# Altium schematic sheet atmega128 schematic.SchDoc
size A2; SheetNumber: 1; SheetTotal: 1; SPICEModelCacheGVUNZBFE: <root> / <DocumentId>GVUNZBFE</DocumentId> / <CacheFrame Number="0"> / <Model Name="zener" Kind="MDL"> / <Text>*ZENER / *Default Zener 10V @ 10mA / *Zener Diode Pinout: A,K / .MODEL ZENER D( BV=10 IBV=10E-3 )</Text> / </Model> / <Model Name="led0" Kind="MDL"> / <Text>*Typ INFRARED GaAs LED: Vf=1.2V Vr=5V If=40mA trr=3uS / *LED Pinout: 1=A, 2=K / .MODEL LED0 D (IS=93.5P RS=84M N=2.63 BV=5 IBV=10U / + CJO=2.97P VJ=.75 M=.333 TT=4.32U)</Text> / </Model> / <Model Name="xtal" Kind="CKT"> / <Text>*Generic type:crystal pkg:HC33/51 / .SUBCKT XTAL 1 2 PARAMS: FREQ=1Meg RS=750 C=13pf Q=1000 / LX 1 3 {((Q*RS)/(6.2831852*FREQ))} IC=0.5M / CX 3 4 {(1/(Q*6.2831852*FREQ*RS))} / C0 1 2 {C} / RS 4 2 {RS} / .ENDS XTAL</Text> / </Model> / <Model Name="dpsw4" Kind="CKT"> / <Text>* DIP switch 4 / * jjt 20/6/2002: created / * / *             Switch connections: / *             sw1 / *             |  |  sw2 / *             |  |  |  |  sw3 / *             |  |  |  |  |  |   sw4 / *             |  |  |  |  |  |  |   | / *             |  |  |  |  |  |  |   | / .subckt dpsw4 1  2  4  5  7  8  10  11 / + PARAMS: STATE1=0 STATE2=0 STATE3=0 STATE4=0 RON=1m ROFF=100E6 / * / V1 3  0 {STATE1} / V2 6  0 {STATE2} / V3 9  0 {STATE3} / V4 12 0 {STATE4} / * / SDIP1 1  2  3  0 DIPMOD / SDIP2 4  5  6  0 DIPMOD / SDIP3 7  8  9  0 DIPMOD / SDIP4 10 11 12 0 DIPMOD / * / .MODEL DIPMOD SW(VT=0.5 RON={RON} ROFF={ROFF}) / .ends dpsw4</Text> / </Model> / <Model Name="npn" Kind="MDL"> / <Text>*Default NPN BJT / *NPN Trans Pinout: C,B,E / .MODEL NPN NPN()</Text> / </Model> / <Model Name="spdtrelay" Kind="CKT"> / <Text>*Generic SPDT Relay / *Connections:     COM / *                 | NC / *                 | | NO / *                 | | | T1 / *                 | | | | T2 / *                 | | | | | / .SUBCKT SPDTRELAY 1 2 3 4 5 / + PARAMS: PULLIN=4 DROPOFF=0.1 CONTACT=1m RESISTANCE=500 INDUCTANCE=10m / L1 4 6 {(INDUCTANCE/2)} / L2 5 7 {(INDUCTANCE/2)} / R1 6 7 {RESISTANCE} / BNO 8 0 V={PULLIN}-abs(v(6,7)) / SW1 2 1 8 0 SWNC ON / BNC 9 0 V=abs(v(6,7)) / SW2 3 1 9 0 SWNO OFF / .MODEL SWNC SW(VT={DROPOFF} RON={CONTACT} ) / .MODEL SWNO SW(VT={(PULLIN*0.98)} RON={CONTACT} ) / .ENDS SPDTRELAY</Text> / </Model> / <Model Name="diode" Kind="MDL"> / <Text>*Default Diode / *Diode Pinout: A,K / .MODEL DIODE D()</Text> / </Model> / </CacheFrame> / </root>
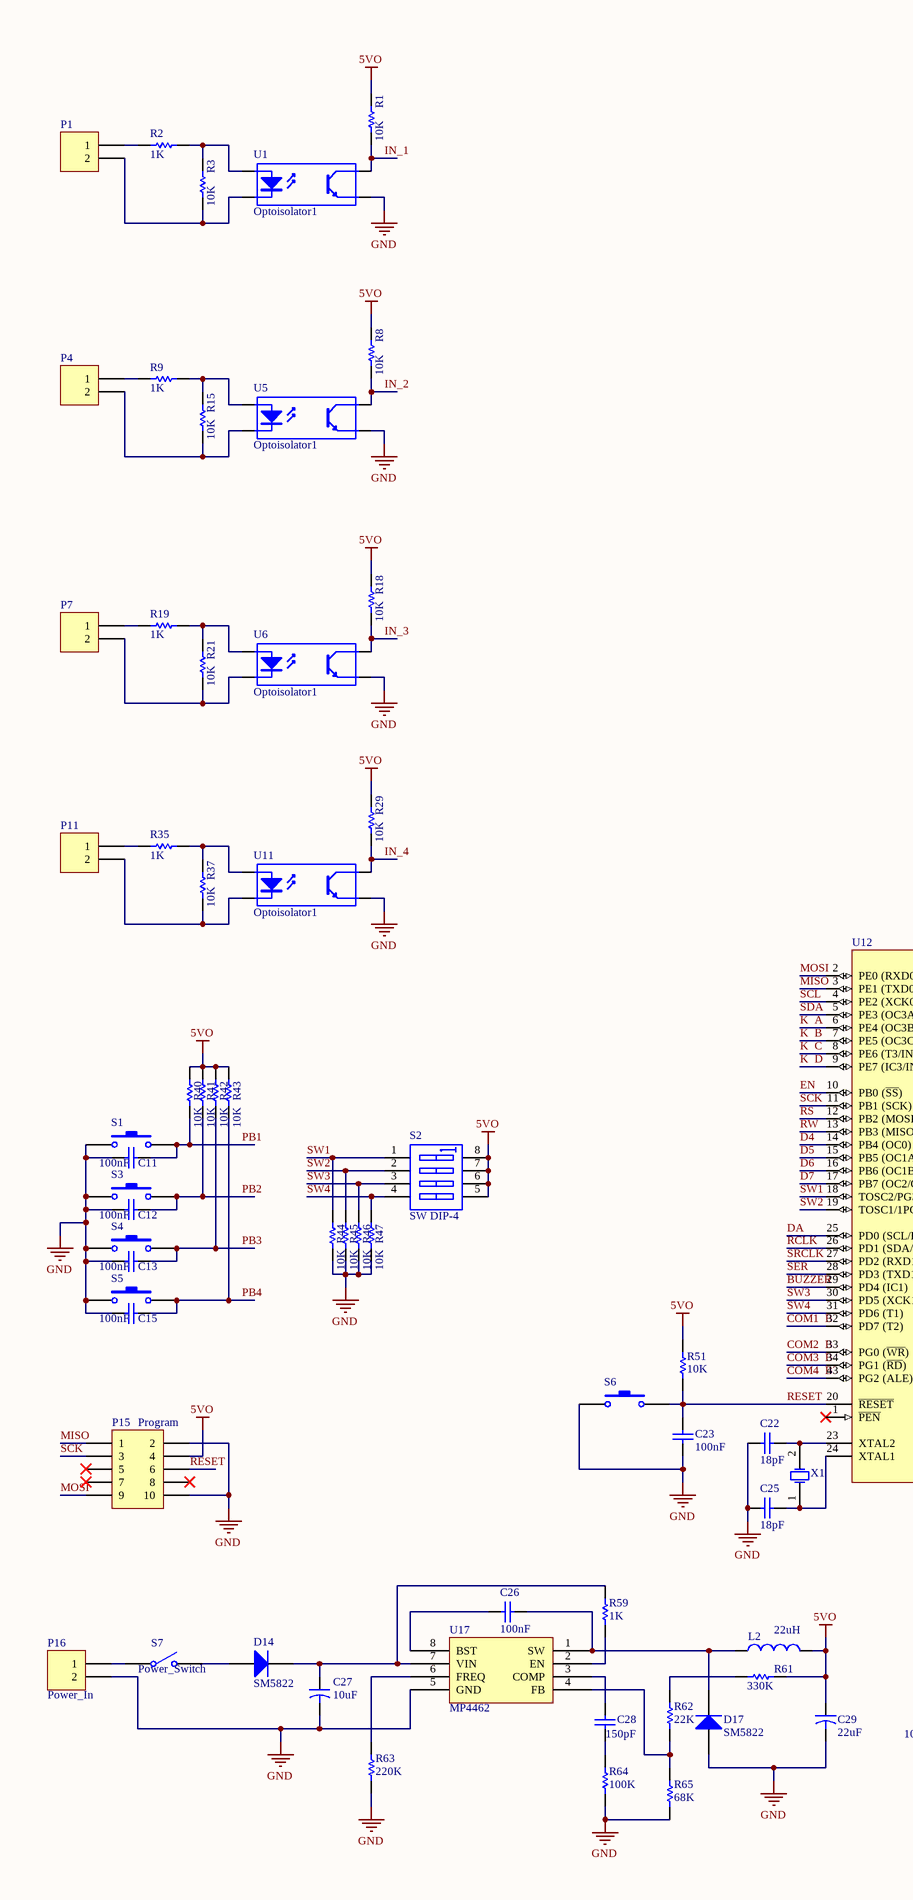
[diagram p0: atmega128 schematic.SchDoc, left]
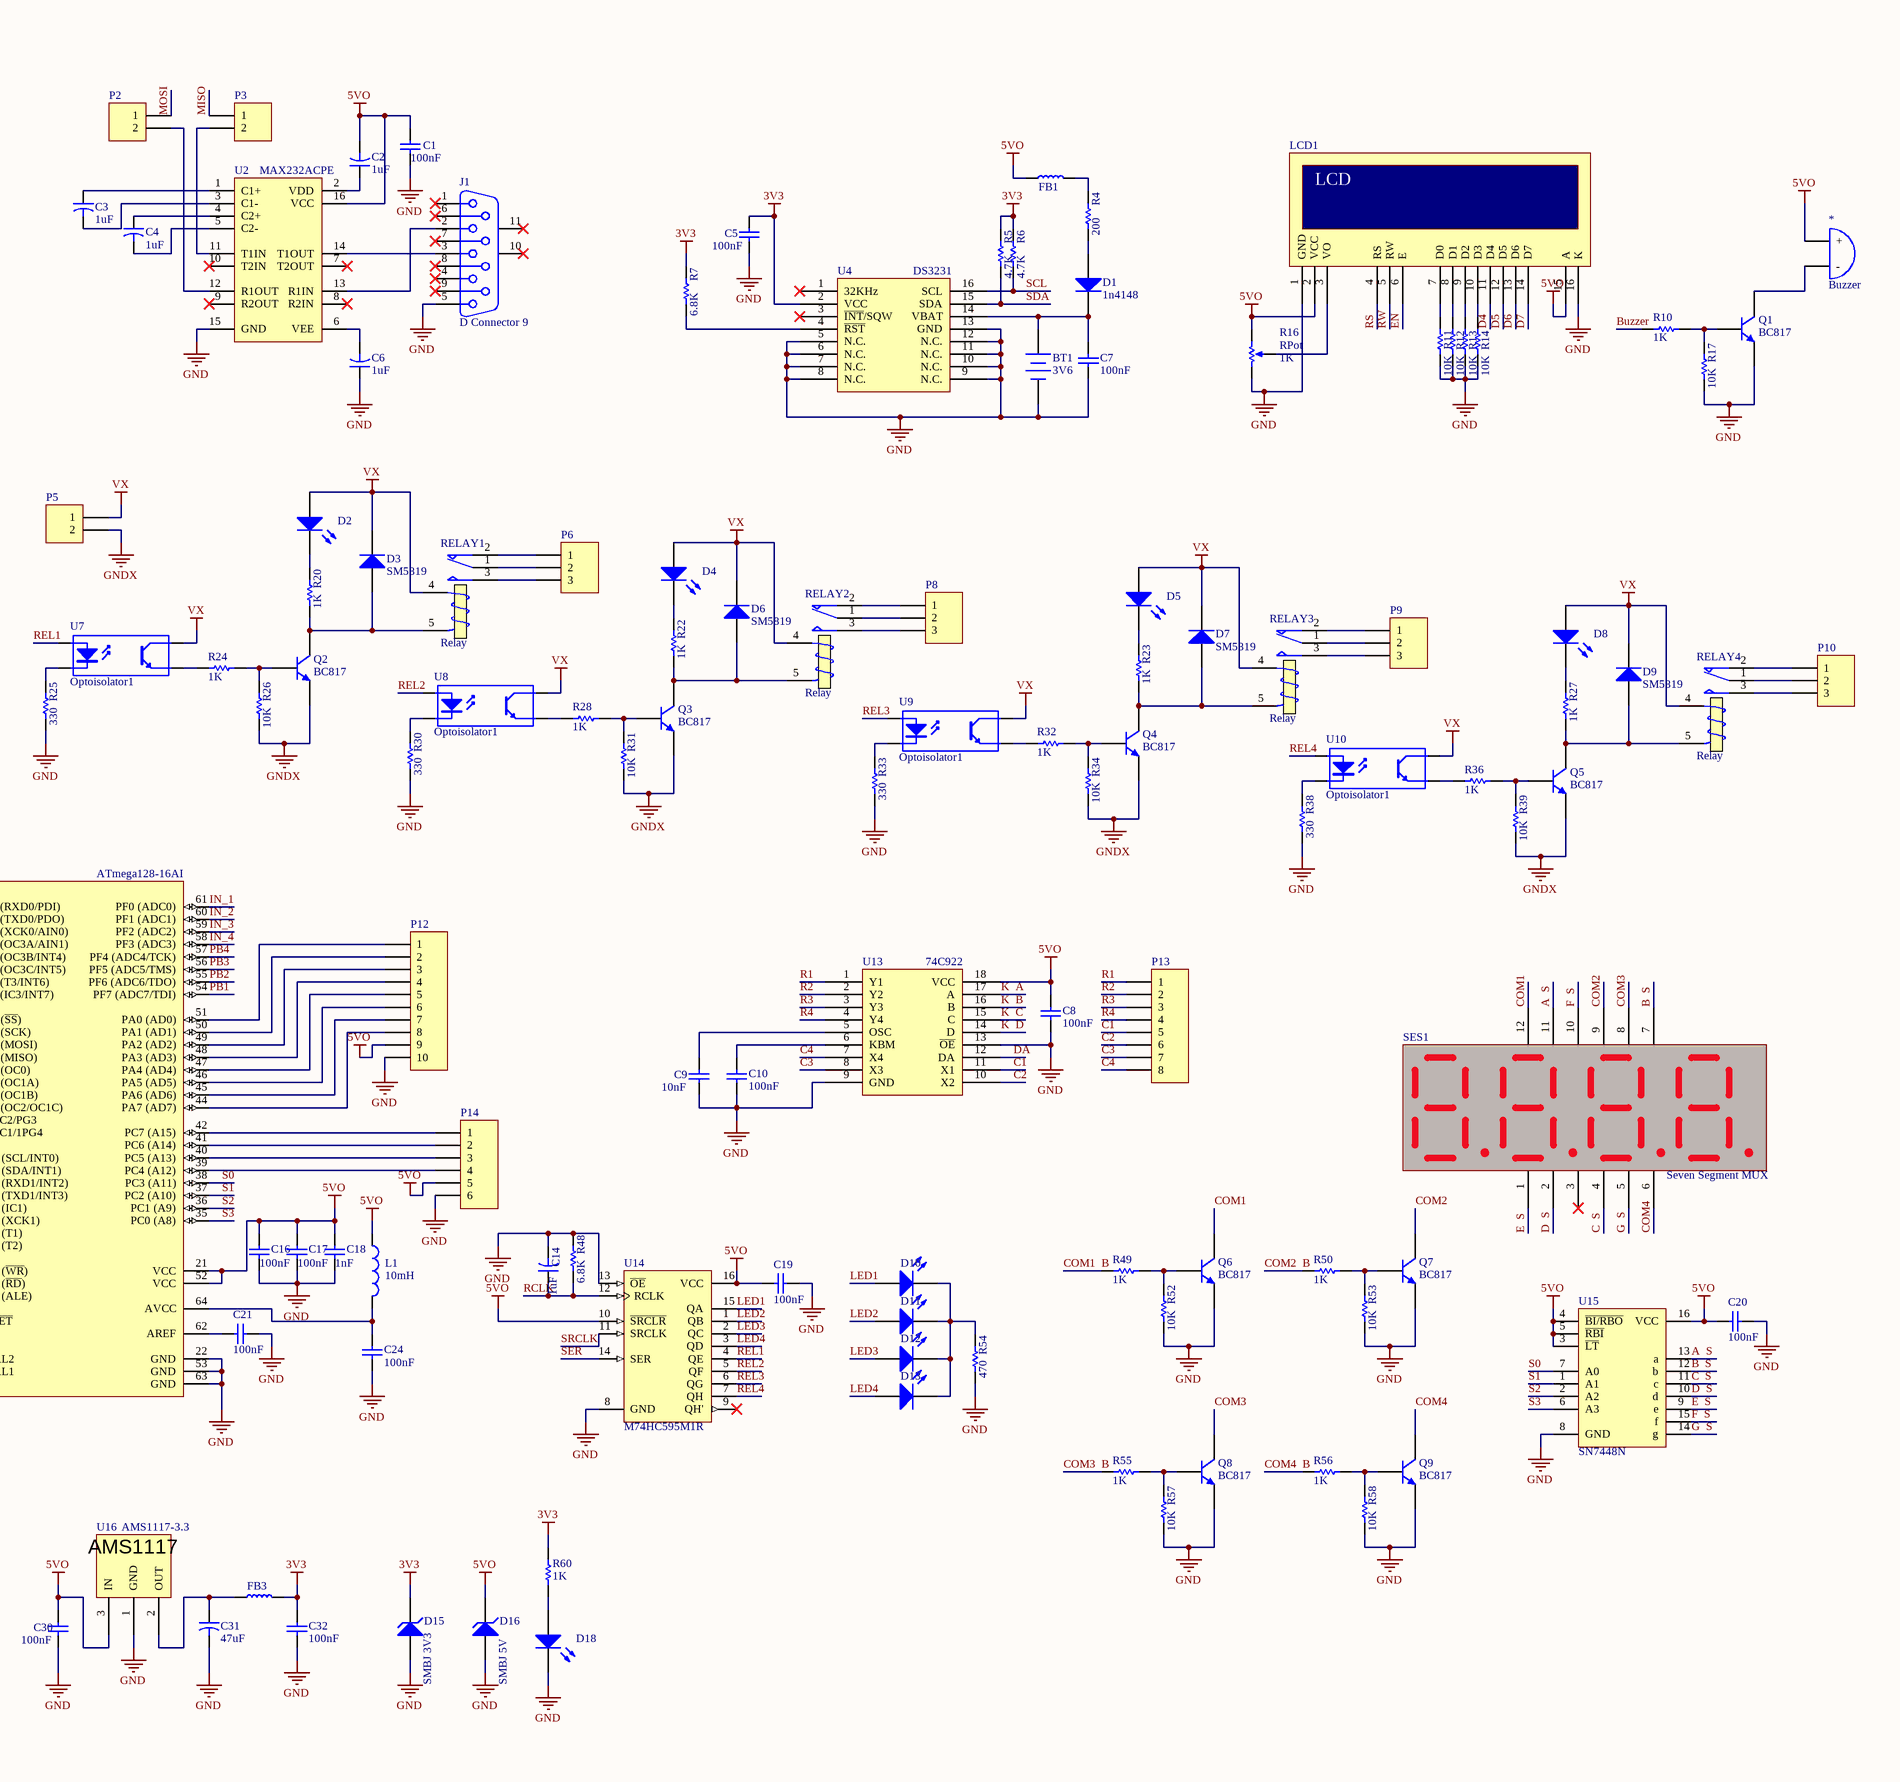
[diagram p1: atmega128 schematic.SchDoc, right]

## Parts
*  Buzzer  [buzzer]
BT1  3V6  [charging_batt]
C1  value 100nF  [SMD_805]  (hidden comment: Cap)
C2  value 1uF  [cap_smd_a]  (hidden comment: Cap2)
C3  value 1uF  [cap_smd_a]  (hidden comment: Cap2)
C4  value 1uF  [cap_smd_a]  (hidden comment: Cap2)
C5  value 100nF  [SMD_805]  (hidden comment: Cap)
C6  value 1uF  [cap_smd_a]  (hidden comment: Cap2)
C7  value 100nF  [SMD_805]  (hidden comment: Cap)
C8  value 100nF  [SMD_805]  (hidden comment: Cap)
C9  value 10nF  [SMD_805]  (hidden comment: Cap)
C10  value 100nF  [SMD_805]  (hidden comment: Cap)
C11  value 100nF  [SMD_805]  (hidden comment: Cap)
C12  value 100nF  [SMD_805]  (hidden comment: Cap)
C13  value 100nF  [SMD_805]  (hidden comment: Cap)
C14  value 1uF  [cap_smd_a]  (hidden comment: Cap2)
C15  value 100nF  [SMD_805]  (hidden comment: Cap)
C16  value 100nF  [SMD_805]  (hidden comment: Cap)
C17  value 100nF  [SMD_805]  (hidden comment: Cap)
C18  value 1nF  [SMD_805]  (hidden comment: Cap)
C19  value 100nF  [SMD_805]  (hidden comment: Cap)
C20  value 100nF  [SMD_805]  (hidden comment: Cap)
C21  value 100nF  [SMD_805]  (hidden comment: Cap)
C22  value 18pF  [SMD_805]  (hidden comment: Cap)
C23  value 100nF  [SMD_805]  (hidden comment: Cap)
C24  value 100nF  [SMD_805]  (hidden comment: Cap)
C25  value 18pF  [SMD_805]  (hidden comment: Cap)
C26  value 100nF  [SMD_805]  (hidden comment: Cap)
C27  value 10uF  [c_b]  (hidden comment: Cap2)
C28  value 150pF  [SMD_805]  (hidden comment: Cap)
C29  value 22uF  [cap_smd_a]  (hidden comment: Cap2)
C30  value 100nF  [SMD_805]  (hidden comment: Cap)
C31  value 47uF  [cap_smd_a]  (hidden comment: Cap2)
C32  value 100nF  [SMD_805]  (hidden comment: Cap)
D1  1n4148  [tvs]
D2  LED0  [SMD_805]  (value not drawn)
D3  SM5819  [tvs]
D4  LED0  [SMD_805]  (value not drawn)
D5  LED0  [SMD_805]  (value not drawn)
D6  SM5819  [tvs]
D7  SM5819  [tvs]
D8  LED0  [SMD_805]  (value not drawn)
D9  SM5819  [tvs]
D10  LED0  [SMD_805]  (value not drawn)
D11  LED0  [SMD_805]  (value not drawn)
D12  LED0  [SMD_805]  (value not drawn)
D13  LED0  [SMD_805]  (value not drawn)
D14  SM5822  [tvs]
D15  SMBJ 3V3  [tvs]
D16  SMBJ 5V  [tvs]
D17  SM5822  [tvs]
D18  LED0  [SMD_805]  (value not drawn)
FB1  Ferrit Bead  [smd_1206]  (value not drawn)
FB3  Ferrit Bead  [SMD_1206]  (value not drawn)
J1  D Connector 9  [com]
L1  value 10mH  [smd_805]  (hidden comment: Inductor)
L2  value 22uH  [inductor_smd_cd54]  (hidden comment: Inductor)
LCD1  LCD16*2  [LCD2X16]  (value not drawn)
P1  Header 2  [phoenix_2]  (value not drawn)
P2  Header 2  [pin_2_w]  (value not drawn)
P3  Header 2  [pin_2_w]  (value not drawn)
P4  Header 2  [phoenix_2]  (value not drawn)
P5  Header 2  [phoenix_2]  (value not drawn)
P6  Header 3  [phoenix_3]  (value not drawn)
P7  Header 2  [phoenix_2]  (value not drawn)
P8  Header 3  [phoenix_3]  (value not drawn)
P9  Header 3  [phoenix_3]  (value not drawn)
P10  Header 3  [phoenix_3]  (value not drawn)
P11  Header 2  [phoenix_2]  (value not drawn)
P12  Header 10  [HDR1X10]  (value not drawn)
P13  Header 8  [HDR1X8]  (value not drawn)
P14  Header 6  [HDR1X6]  (value not drawn)
P15  Program  [box2x5_3d]
P16  Power_In  [adap_jack2]
Q1  BC817  [SOT23]
Q2  BC817  [SOT23]
Q3  BC817  [SOT23]
Q4  BC817  [SOT23]
Q5  BC817  [SOT23]
Q6  BC817  [SOT23]
Q7  BC817  [SOT23]
Q8  BC817  [SOT23]
Q9  BC817  [SOT23]
R1  value 10K  [SMD_805]  (hidden comment: Res1)
R2  value 1K  [SMD_805]  (hidden comment: Res1)
R3  value 10K  [SMD_805]  (hidden comment: Res1)
R4  value 200  [SMD_805]  (hidden comment: Res1)
R5  value 4.7K  [SMD_805]  (hidden comment: Res1)
R6  value 4.7K  [SMD_805]  (hidden comment: Res1)
R7  value 6.8K  [SMD_805]  (hidden comment: Res1)
R8  value 10K  [SMD_805]  (hidden comment: Res1)
R9  value 1K  [SMD_805]  (hidden comment: Res1)
R10  value 1K  [SMD_805]  (hidden comment: Res1)
R11  value 10K  [SMD_805]  (hidden comment: Res1)
R12  value 10K  [SMD_805]  (hidden comment: Res1)
R13  value 10K  [SMD_805]  (hidden comment: Res1)
R14  value 10K  [SMD_805]  (hidden comment: Res1)
R15  value 10K  [SMD_805]  (hidden comment: Res1)
R16  RPot  value 1K  [pot]
R17  value 10K  [SMD_805]  (hidden comment: Res1)
R18  value 10K  [SMD_805]  (hidden comment: Res1)
R19  value 1K  [SMD_805]  (hidden comment: Res1)
R20  value 1K  [SMD_805]  (hidden comment: Res1)
R21  value 10K  [SMD_805]  (hidden comment: Res1)
R22  value 1K  [SMD_805]  (hidden comment: Res1)
R23  value 1K  [SMD_805]  (hidden comment: Res1)
R24  value 1K  [SMD_805]  (hidden comment: Res1)
R25  value 330  [SMD_805]  (hidden comment: Res1)
R26  value 10K  [SMD_805]  (hidden comment: Res1)
R27  value 1K  [SMD_805]  (hidden comment: Res1)
R28  value 1K  [SMD_805]  (hidden comment: Res1)
R29  value 10K  [SMD_805]  (hidden comment: Res1)
R30  value 330  [SMD_805]  (hidden comment: Res1)
R31  value 10K  [SMD_805]  (hidden comment: Res1)
R32  value 1K  [SMD_805]  (hidden comment: Res1)
R33  value 330  [SMD_805]  (hidden comment: Res1)
R34  value 10K  [SMD_805]  (hidden comment: Res1)
R35  value 1K  [SMD_805]  (hidden comment: Res1)
R36  value 1K  [SMD_805]  (hidden comment: Res1)
R37  value 10K  [SMD_805]  (hidden comment: Res1)
R38  value 330  [SMD_805]  (hidden comment: Res1)
R39  value 10K  [SMD_805]  (hidden comment: Res1)
R40  value 10K  [SMD_805]  (hidden comment: Res1)
R41  value 10K  [SMD_805]  (hidden comment: Res1)
R42  value 10K  [SMD_805]  (hidden comment: Res1)
R43  value 10K  [SMD_805]  (hidden comment: Res1)
R44  value 10K  [SMD_805]  (hidden comment: Res1)
R45  value 10K  [SMD_805]  (hidden comment: Res1)
R46  value 10K  [SMD_805]  (hidden comment: Res1)
R47  value 10K  [SMD_805]  (hidden comment: Res1)
R48  value 6.8K  [SMD_805]  (hidden comment: Res1)
R49  value 1K  [SMD_805]  (hidden comment: Res1)
R50  value 1K  [SMD_805]  (hidden comment: Res1)
R51  value 10K  [SMD_805]  (hidden comment: Res1)
R52  value 10K  [SMD_805]  (hidden comment: Res1)
R53  value 10K  [SMD_805]  (hidden comment: Res1)
R54  value 470  [SMD_805]  (hidden comment: Res1)
R55  value 1K  [SMD_805]  (hidden comment: Res1)
R56  value 1K  [SMD_805]  (hidden comment: Res1)
R57  value 10K  [SMD_805]  (hidden comment: Res1)
R58  value 10K  [SMD_805]  (hidden comment: Res1)
R59  value 1K  [SMD_805]  (hidden comment: Res1)
R60  value 1K  [SMD_805]  (hidden comment: Res1)
R61  value 330K  [SMD_805]  (hidden comment: Res1)
R62  value 22K  [SMD_805]  (hidden comment: Res1)
R63  value 220K  [SMD_805]  (hidden comment: Res1)
R64  value 100K  [SMD_805]  (hidden comment: Res1)
R65  value 68K  [SMD_805]  (hidden comment: Res1)
RELAY1  Relay  [relay_12v]
RELAY2  Relay  [relay_12v]
RELAY3  Relay  [relay_12v]
RELAY4  Relay  [relay_12v]
S1  Reset  [smd_button]  (value not drawn)
S2  SW DIP-4  [dip_8p]
S3  Reset  [smd_button]  (value not drawn)
S4  Reset  [smd_button]  (value not drawn)
S5  Reset  [smd_button]  (value not drawn)
S6  Reset  [smd_button]  (value not drawn)
S7  Power_Switch  [sw_6pin]
SES1  Seven Segment MUX  [4DIGIT_SEVEN]
U1  Optoisolator1  [pc817_smd]
U2  MAX232ACPE  [SOP16]
U4  DS3231  [SO16]
U5  Optoisolator1  [pc817_smd]
U6  Optoisolator1  [pc817_smd]
U7  Optoisolator1  [pc817_smd]
U8  Optoisolator1  [pc817_smd]
U9  Optoisolator1  [pc817_smd]
U10  Optoisolator1  [pc817_smd]
U11  Optoisolator1  [pc817_smd]
U12  ATmega128-16AI  [atm128]
U13  74C922  [DIP_18P]
U14  M74HC595M1R  [SO16_L]
U15  SN7448N  [DIP_16P]
U16  AMS1117-3.3  [SOT223]
U17  MP4462  [SOP_8_NEW]
X1  XTAL  [xtal_smd]  (value not drawn)

## Nets
3V3: C5.1 C32.2 D15.2(K) FB3.2 R5.1 R6.1 R7.1 R60.1 U4.2(VCC)
5VO: *.1(+) C1.1 C2.2 C8.1 C16.1 C17.1 C18.1 C19.1 C20.1 C29.1 C30.2 D16.2(K) FB1.1 L1.1 L2.2 LCD1.2(VCC) LCD1.15(A) P12.9 P14.5 P15.4 R1.1 R8.1 R16.1(TOP) R18.1 R29.1 R40.1 R41.1 R42.1 R43.1 R51.1 R61.1 S2.5(B4) S2.6(B3) S2.7(B2) S2.8(B1) U2.16(VCC) U12.21(VCC) U12.52(VCC) U13.18(VCC) U14.10(~{SRCLR}) U14.16(VCC) U15.3(~{LT}) U15.4(~{BI/RBO}) U15.5(~{RBI}) U15.16(VCC) U16.3(IN)
GND: BT1.2(-) C1.2 C5.2 C6.1 C7.2 C8.2 C9.2 C10.2 C11.2 C12.2 C13.2 C14.2 C15.2 C16.2 C17.2 C18.2 C19.2 C20.2 C21.2 C22.2 C23.1 C24.2 C25.2 C27.2 C29.2 C30.1 C31.2 C32.1 D15.1(A) D16.1(A) D17.1(A) D18.2(K) J1.5 LCD1.1(GND) LCD1.16(K) P12.10 P14.6 P15.2 P15.10 P16.2 Q1.2(E) Q6.2(E) Q7.2(E) Q8.2(E) Q9.2(E) R11.2 R12.2 R13.2 R14.2 R16.2(BOT) R17.2 R25.2 R30.2 R33.2 R38.2 R44.2 R45.2 R46.2 R47.2 R48.1 R52.2 R53.2 R54.2 R57.2 R58.2 R63.1 R64.1 R65.1 S1.1 S3.1 S4.1 S5.1 S6.1 U1.3(E) U2.15(GND) U4.5(N.C.) U4.6(N.C.) U4.7(N.C.) U4.8(N.C.) U4.9(N.C.) U4.10(N.C.) U4.11(N.C.) U4.12(N.C.) U4.13(GND) U5.3(E) U6.3(E) U11.3(E) U12.22(GND) U12.53(GND) U12.63(GND) U13.9(GND) U13.13(~{OE}) U14.8(GND) U14.13(~{OE}) U15.8(GND) U16.1(GND) U17.5(GND)
GNDX: P5.2 Q2.2(E) Q3.2(E) Q4.2(E) Q5.2(E) R26.2 R31.2 R34.2 R39.2
VX: D2.1(A) D3.2(K) D4.1(A) D5.1(A) D6.2(K) D7.2(K) D8.1(A) D9.2(K) P5.1 RELAY1.4(T1) RELAY2.4(T1) RELAY3.4(T1) RELAY4.4(T1) U7.4(C) U8.4(C) U9.4(C) U10.4(C)
A  S: SES1.11(A) U15.13(a)
B  S: SES1.7(B) U15.12(b)
Buzzer: R10.1 U12.29(PD4_(IC1))
C1: P13.5 U13.11(X1)
C2: P13.6 U13.10(X2)
C3: P13.7 U13.8(X3)
C4: P13.8 U13.7(X4)
C  S: SES1.4(C) U15.11(c)
COM1: Q6.3(C) SES1.12(D1)
COM1  B: R49.1 U12.32(PD7_(T2))
COM2: Q7.3(C) SES1.9(D2)
COM2  B: R50.1 U12.33(PG0_(~{WR}))
COM3: Q8.3(C) SES1.8(D3)
COM3  B: R55.1 U12.34(PG1_(~{RD}))
COM4: Q9.3(C) SES1.6(D4)
COM4  B: R56.1 U12.43(PG2_(ALE))
D4: LCD1.11(D4) U12.14(PB4_(OC0))
D5: LCD1.12(D5) U12.15(PB5_(OC1A))
D6: LCD1.13(D6) U12.16(PB6_(OC1B))
D7: LCD1.14(D7) U12.17(PB7_(OC2/OC1C))
D  S: SES1.2(D) U15.10(d)
DA: U12.25(PD0_(SCL/INT0)) U13.12(DA)
E  S: SES1.1(E) U15.9(e)
EN: LCD1.6(E) U12.10(PB0_(~{SS}))
F  S: SES1.10(F) U15.15(f)
G  S: SES1.5(G) U15.14(g)
IN_1: R1.2 U1.4(C) U12.61(PF0_(ADC0))
IN_2: R8.2 U5.4(C) U12.60(PF1_(ADC1))
IN_3: R18.2 U6.4(C) U12.59(PF2_(ADC2))
IN_4: R29.2 U11.4(C) U12.58(PF3_(ADC3))
K  A: U12.6(PE4_(OC3B/INT4)) U13.17(A)
K  B: U12.7(PE5_(OC3C/INT5)) U13.16(B)
K  C: U12.8(PE6_(T3/INT6)) U13.15(C)
K  D: U12.9(PE7_(IC3/INT7)) U13.14(D)
LED1: D10.1(A) U14.15(QA)
LED2: D11.1(A) U14.1(QB)
LED3: D12.1(A) U14.2(QC)
LED4: D13.1(A) U14.3(QD)
MISO: P3.1 P15.1 U12.3(PE1_(TXD0/PDO))
MOSI: P2.1 P15.9 U12.2(PE0_(RXD0/PDI))
PB1: C11.1 R40.2 S1.2 U12.54(PF7_(ADC7/TDI))
PB2: C12.1 R41.2 S3.2 U12.55(PF6_(ADC6/TDO))
PB3: C13.1 R42.2 S4.2 U12.56(PF5_(ADC5/TMS))
PB4: C15.1 R43.2 S5.2 U12.57(PF4_(ADC4/TCK))
R1: P13.1 U13.1(Y1)
R2: P13.2 U13.2(Y2)
R3: P13.3 U13.3(Y3)
R4: P13.4 U13.4(Y4)
RCLK: C14.1 R48.2 U12.26(PD1_(SDA/INT1)) U14.12(RCLK)
REL1: U7.1(A) U14.4(QE)
REL2: U8.1(A) U14.5(QF)
REL3: U9.1(A) U14.6(QG)
REL4: U10.1(A) U14.7(QH)
RESET: C23.2 P15.6 R51.2 S6.2 U12.20(~{RESET})
RS: LCD1.4(RS) U12.12(PB2_(MOSI))
RW: LCD1.5(RW) U12.13(PB3_(MISO))
S0: U12.38(PC3_(A11)) U15.7(A0)
S1: U12.37(PC2_(A10)) U15.1(A1)
S2: U12.36(PC1_(A9)) U15.2(A2)
S3: U12.35(PC0_(A8)) U15.6(A3)
SCK: P15.3 U12.11(PB1_(SCK))
SCL: R6.2 U4.16(SCL) U12.4(PE2_(XCK0/AIN0))
SDA: R5.2 U4.15(SDA) U12.5(PE3_(OC3A/AIN1))
SER: U12.28(PD3_(TXD1/INT3)) U14.14(SER)
SRCLK: U12.27(PD2_(RXD1/INT2)) U14.11(SRCLK)
SW1: R44.1 S2.1(A1) U12.18(TOSC2/PG3)
SW2: R45.1 S2.2(A2) U12.19(TOSC1/1PG4)
SW3: R46.1 S2.3(A3) U12.30(PD5_(XCK1))
SW4: R47.1 S2.4(A4) U12.31(PD6_(T1))
Net*_2: *.2(-) Q1.3(C)
NetBT1_1: BT1.1(+) C7.1 D1.2(K) U4.14(VBAT)
NetC2_1: C2.1 U2.2(VDD)
NetC3_1: C3.1 U2.1(C1+)
NetC3_2: C3.2 U2.3(C1-)
NetC4_1: C4.1 U2.4(C2+)
NetC4_2: C4.2 U2.5(C2-)
NetC6_2: C6.2 U2.6(VEE)
NetC9_1: C9.1 U13.5(OSC)
NetC10_1: C10.1 U13.6(KBM)
NetC21_1: C21.1 U12.62(AREF)
NetC22_1: C22.1 U12.23(XTAL2) X1.2(OSC2)
NetC24_1: C24.1 L1.2 U12.64(AVCC)
NetC25_1: C25.1 U12.24(XTAL1) X1.1(OSC1)
NetC26_1: C26.1 U17.8(BST)
NetC26_2: C26.2 D17.2(K) L2.1 U17.1(SW)
NetC27_1: C27.1 D14.2(K) R59.2 U17.7(VIN)
NetC28_1: C28.1 R64.2
NetC28_2: C28.2 U17.3(COMP)
NetC31_1: C31.1 FB3.1 U16.2(OUT)
NetD1_1: D1.1(A) R4.2
NetD2_2: D2.2(K) R20.1
NetD3_1: D3.1(A) Q2.3(C) R20.2 RELAY1.5(T2)
NetD4_2: D4.2(K) R22.1
NetD5_2: D5.2(K) R23.1
NetD6_1: D6.1(A) Q3.3(C) R22.2 RELAY2.5(T2)
NetD7_1: D7.1(A) Q4.3(C) R23.2 RELAY3.5(T2)
NetD8_2: D8.2(K) R27.1
NetD9_1: D9.1(A) Q5.3(C) R27.2 RELAY4.5(T2)
NetD10_2: D10.2(K) D11.2(K) D12.2(K) D13.2(K) R54.1
NetD14_1: D14.1(A) S7.2(NO)
NetD18_1: D18.1(A) R60.2
NetFB1_2: FB1.2 R4.1
NetJ1_2: J1.2 U2.13(R1IN)
NetJ1_3: J1.3 U2.14(T1OUT)
NetLCD1_3: LCD1.3(VO) R16.3(TAP)
NetLCD1_7: LCD1.7(D0) R11.1
NetLCD1_8: LCD1.8(D1) R12.1
NetLCD1_9: LCD1.9(D2) R13.1
NetLCD1_10: LCD1.10(D3) R14.1
NetP1_1: P1.1 R2.1
NetP1_2: P1.2 R3.2 U1.2(K)
NetP2_2: P2.2 U2.12(R1OUT)
NetP3_2: P3.2 U2.11(T1IN)
NetP4_1: P4.1 R9.1
NetP4_2: P4.2 R15.2 U5.2(K)
NetP6_1: P6.1 RELAY1.2(NC)
NetP6_2: P6.2 RELAY1.1(COM)
NetP6_3: P6.3 RELAY1.3(NO)
NetP7_1: P7.1 R19.1
NetP7_2: P7.2 R21.2 U6.2(K)
NetP8_1: P8.1 RELAY2.2(NC)
NetP8_2: P8.2 RELAY2.1(COM)
NetP8_3: P8.3 RELAY2.3(NO)
NetP9_1: P9.1 RELAY3.2(NC)
NetP9_2: P9.2 RELAY3.1(COM)
NetP9_3: P9.3 RELAY3.3(NO)
NetP10_1: P10.1 RELAY4.2(NC)
NetP10_2: P10.2 RELAY4.1(COM)
NetP10_3: P10.3 RELAY4.3(NO)
NetP11_1: P11.1 R35.1
NetP11_2: P11.2 R37.2 U11.2(K)
NetP12_1: P12.1 U12.51(PA0_(AD0))
NetP12_2: P12.2 U12.50(PA1_(AD1))
NetP12_3: P12.3 U12.49(PA2_(AD2))
NetP12_4: P12.4 U12.48(PA3_(AD3))
NetP12_5: P12.5 U12.47(PA4_(AD4))
NetP12_6: P12.6 U12.46(PA5_(AD5))
NetP12_7: P12.7 U12.45(PA6_(AD6))
NetP12_8: P12.8 U12.44(PA7_(AD7))
NetP14_1: P14.1 U12.42(PC7_(A15))
NetP14_2: P14.2 U12.41(PC6_(A14))
NetP14_3: P14.3 U12.40(PC5_(A13))
NetP14_4: P14.4 U12.39(PC4_(A12))
NetP16_1: P16.1 S7.1(COMMON)
NetQ1_1: Q1.1(B) R10.2 R17.1
NetQ2_1: Q2.1(B) R24.2 R26.1
NetQ3_1: Q3.1(B) R28.2 R31.1
NetQ4_1: Q4.1(B) R32.2 R34.1
NetQ5_1: Q5.1(B) R36.2 R39.1
NetQ6_1: Q6.1(B) R49.2 R52.1
NetQ7_1: Q7.1(B) R50.2 R53.1
NetQ8_1: Q8.1(B) R55.2 R57.1
NetQ9_1: Q9.1(B) R56.2 R58.1
NetR2_2: R2.2 R3.1 U1.1(A)
NetR7_2: R7.2 U4.4(~{RST})
NetR9_2: R9.2 R15.1 U5.1(A)
NetR19_2: R19.2 R21.1 U6.1(A)
NetR24_1: R24.1 U7.3(E)
NetR25_1: R25.1 U7.2(K)
NetR28_1: R28.1 U8.3(E)
NetR30_1: R30.1 U8.2(K)
NetR32_1: R32.1 U9.3(E)
NetR33_1: R33.1 U9.2(K)
NetR35_2: R35.2 R37.1 U11.1(A)
NetR36_1: R36.1 U10.3(E)
NetR38_1: R38.1 U10.2(K)
NetR59_1: R59.1 U17.2(EN)
NetR61_2: R61.2 R62.2
NetR62_1: R62.1 R65.2 U17.4(FB)
NetR63_2: R63.2 U17.6(FREQ)

Not connected (* = marked no-connect by the designer): J1 1* 4* 6* 7* 8* 9* 10(MH1)* 11(MH2)*; P15 5* 7* 8*; SES1 3(DEC)*; U2 7(T2OUT)* 8(R2IN)* 9(R2OUT)* 10(T2IN)*; U4 1(32KHz)* 3(~{INT}/SQW)*; U12 1(~{PEN})*; U14 9(QH')*

## Notes on the sheet
- (in symbol 4DIGIT_7SEG) .
- (in symbol LCD16*2) LCD

## Library data of the parts
BT1 = Battery: Multicell Battery; Published: 24-Mar-1999; LatestRevisionDate: 17-Jul-2002; LatestRevisionNote: Re-released for DXP Platform.; PackageReference: BAT-2; Publisher: Altium Limited
C1 C5 C7-C13 C15-C26 C28 C30 C32 = Cap: Capacitor; Published: 8-Jun-2000; LatestRevisionDate: 17-Jul-2002; LatestRevisionNote: Re-released for DXP Platform.; PackageReference: RAD-0.3; Publisher: Altium Limited
C2-C4 C6 C14 C27 C29 C31 = Cap2: Capacitor; Published: 23-Sep-2002; PackageReference: CAPR5-4X5; Publisher: Altium Limited
D1 D3 D6 D7 D9 D14 D17 = Diode: Default Diode; Published: 8-Jun-2000; LatestRevisionDate: 17-Jul-2002; LatestRevisionNote: Re-released for DXP Platform.; PackageVersion: Sep-1996; PackageReference: SMC; Publisher: Altium Limited; Code_JEDEC: DO-214-AB
D2 D4 D5 D8 D10-D13 D18 = LED0: Typical INFRARED GaAs LED; Published: 8-Jun-2000; LatestRevisionDate: 08-Jul-2005; LatestRevisionNote: Mech Layer 1 removed.; PackageReference: LED-0; Publisher: Altium Limited
D15 D16 = D Zener: Zener Diode; Published: 8-Jun-2000; LatestRevisionDate: 17-Jul-2002; LatestRevisionNote: Re-released for DXP Platform.; PackageReference: DIODE-0.7; Publisher: Altium Limited
J1 = D Connector 9: Receptacle Assembly, 9 Position, Right Angle; PackageDocument: O; Positions: 9; Published: 15-Jun-2001; LatestRevisionDate: 17-Jul-2002; LatestRevisionNote: Re-released for DXP Platform.; DatasheetDocument: 1-Sep-1999; PackageReference: 788750; Publisher: Altium Limited; Orientation: Right Angle; Gender: Receptacle
L1 L2 = Inductor: Code_IEC: 1005; Published: 8-Jun-2000; LatestRevisionDate: 29-May-2009; LatestRevisionNote: IPC-7351 Footprint Added.; PackageReference: 0402-A; Publisher: Altium Limited; PackageDescription: Chip Inductor; Code_JEITA: 0402
P1-P5 P7 P11 P16 = Header 2: Header, 2-Pin; LatestRevisionDate: 17-Jul-2002; LatestRevisionNote: Re-released for DXP Platform.; Publisher: Altium Limited
P6 P8-P10 = Header 3: Header, 3-Pin; LatestRevisionDate: 17-Jul-2002; LatestRevisionNote: Re-released for DXP Platform.; Publisher: Altium Limited
P12 = Header 10: Header, 10-Pin; LatestRevisionDate: 17-Jul-2002; LatestRevisionNote: Re-released for DXP Platform.; Publisher: Altium Limited
P13 = Header 8: Header, 8-Pin; LatestRevisionDate: 17-Jul-2002; LatestRevisionNote: Re-released for DXP Platform.; Publisher: Altium Limited
P14 = Header 6: Header, 6-Pin; LatestRevisionDate: 17-Jul-2002; LatestRevisionNote: Re-released for DXP Platform.; Publisher: Altium Limited
P15 = Header 5X2: Header, 5-Pin, Dual row; LatestRevisionDate: 17-Jul-2002; LatestRevisionNote: Re-released for DXP Platform.; Publisher: Altium Limited
Q1-Q9 = NPN: NPN Bipolar Transistor; Published: 8-Jun-2000; LatestRevisionDate: 17-Jul-2002; LatestRevisionNote: Re-released for DXP Platform.; PackageReference: TO-226; Publisher: Altium Limited; Code_JEDEC: TO-226-AA
R1-R15 R17-R65 = Res1: Resistor; Published: 8-Jun-2000; LatestRevisionDate: 17-Jul-2002; LatestRevisionNote: Re-released for DXP Platform.; PackageReference: AXIAL-0.3; Publisher: Altium Limited
R16 = RPot: Potentiometer; Sim Note: Enter the Resistance value and the set point into parameter fields.; Set Position: 0.5; Published: 8-Jun-2000; LatestRevisionDate: 17-Jul-2002; LatestRevisionNote: Re-released for DXP Platform.; PackageReference: VR5; Publisher: Altium Limited
RELAY1-RELAY4 = Relay: SPDT Relay; Published: 8-Jun-2000; LatestRevisionDate: 17-Jul-2002; LatestRevisionNote: Re-released for DXP Platform.; PackageReference: MODULE5B; Publisher: Altium Limited
S1 S3-S6 = SW-PB: Switch; Published: 24-Mar-1999; LatestRevisionDate: 17-Jul-2002; LatestRevisionNote: Re-released for DXP Platform.; PackageReference: SPST-2; Publisher: Altium Limited
S2 = SW DIP-4: DIP Switch, 4 Position, SPST; Published: 24-Mar-1999; LatestRevisionDate: 29-May-2009; LatestRevisionNote: IPC-7351 Footprint Added.; PackageVersion: Dec-2002; PackageReference: SO8; Publisher: Altium Limited; PackageDescription: 8-Pin Small Outline Integrated Circuit 1.27 mm Pitch; Code_JEDEC: MS-012-AA; Code_IPC: SOIC127P600-8
S7 = SW-SPST: Single-Pole, Single-Throw Switch; Published: 24-Mar-1999; LatestRevisionDate: 17-Jul-2002; LatestRevisionNote: Re-released for DXP Platform.; PackageReference: SPST-2; Publisher: Altium Limited
SES1 = 4DIGIT_7SEG
U1 U5-U11 = Optoisolator1: 4-Pin Phototransistor Optocoupler; Published: 24-Mar-1999; LatestRevisionDate: 04-Mar-2005; LatestRevisionNote: Sch pins 3 & 4 Swapped.; DatasheetVersion: Nov-2003; PackageReference: DIP-4; Publisher: Altium Limited
U2 = MAX232ACPE: +5V Powered, Multi-Channel RS-232 Driver/Receiver; Published: 16-Jan-2001; LatestRevisionDate: 29-May-2009; LatestRevisionNote: Component Body Added.; PackageVersion: 1997; PackageReference: PE16A; Publisher: Altium Limited; PackageDescription: DIP, 16-Pin, Row Spacing 7.62 mm, Pitch 2.54 mm; Code_JEDEC: MS-001-BB; ComponentLink1Description: Manufacturer Link; ComponentLink1URL: http://www.maxim-ic.com/; ComponentLink2Description: Datasheet; ComponentLink2URL: http://pdfserv.maxim-ic.com/en/ds/MAX220-MAX249.pdf
U12 = ATmega128-16AI: 8-Bit AVR Microcontroller with 128K Bytes of In-System Programmable Flash Memory; Published: 17-Sep-2003; LatestRevisionDate: 16-Oct-2006; LatestRevisionNote: IPC-7351 Footprint Added.; DatasheetVersion: 2467G-AVR-09/02; PackageVersion: revB, Oct-2001; PackageReference: 64A; Publisher: Altium Limited; PackageDescription: 64-Pin Plastic Thin Profile Quad Flat Pack, 14 x 14 x 1.0 mm Body, 0.8 mm Pitch (TQFP); Supplier 1: Digi-Key; Supplier Part Number 1: ATMEGA128-16AI-ND; Supplier 2: Mouser; Supplier Part Number 2: 556-ATMEGA12816AI; Code_JEDEC: MS-026-AEB; ComponentLink1Description: Datasheet; ComponentLink1URL: http://www.atmel.com/dyn/resources/prod_documents/doc2467.pdf; ComponentLink2Description: Atmel.com Home; ComponentLink2URL: http://www.atmel.com
U13 = Component_1
U14 = M74HC595M1R: 8 Bit Shift Register with Output Latches (3 STATE); Published: 8-Jun-2000; LatestRevisionDate: 13-Apr-2006; LatestRevisionNote: IPC-7351 Footprint Added.; DatasheetVersion: Apr-1993; PackageVersion: May-1998; PackageReference: SO16; Publisher: Altium Limited; PackageDescription: 16-Pin Small Outline Integrated Circuit 1.27 mm Pitch; Code_IPC: SOIC127P600-16; ComponentLink1Description: Manufacturer Link; ComponentLink1URL: http://www.st.com/; ComponentLink2Description: Datasheet; ComponentLink2URL: http://www.st.com/stonline/products/literature/ds/1989/m74hc595.pdf
U15 = SN7448N: BCD-to-Seven-Segment Decoder/Driver; ComponentAvailability: Obsolete; Published: 8-Jun-2000; LatestRevisionDate: 29-May-2009; LatestRevisionNote: Component Body Added.; DatasheetVersion: Mar-1988; PackageVersion: Oct-1995; PackageReference: N016; Publisher: Altium Limited; PackageDescription: DIP, 16-Pin, Row Spacing 7.62 mm, Pitch 2.54 mm; Code_JEDEC: MS-001-BB; ComponentLink1Description: Manufacturer Link; ComponentLink1URL: http://www.ti.com/; ComponentLink2Description: Datasheet; ComponentLink2URL: http://www-s.ti.com/sc/ds/sn7448.pdf; ComponentLink3Description: URL Link1; ComponentLink3URL: http://focus.ti.com/docs/prod/folders/print/sn7448.html
U16 = AMS1117
X1 = XTAL: Crystal Oscillator; Published: 8-Jun-2000; LatestRevisionDate: 17-Jul-2002; LatestRevisionNote: Re-released for DXP Platform.; PackageReference: R38; Publisher: Altium Limited